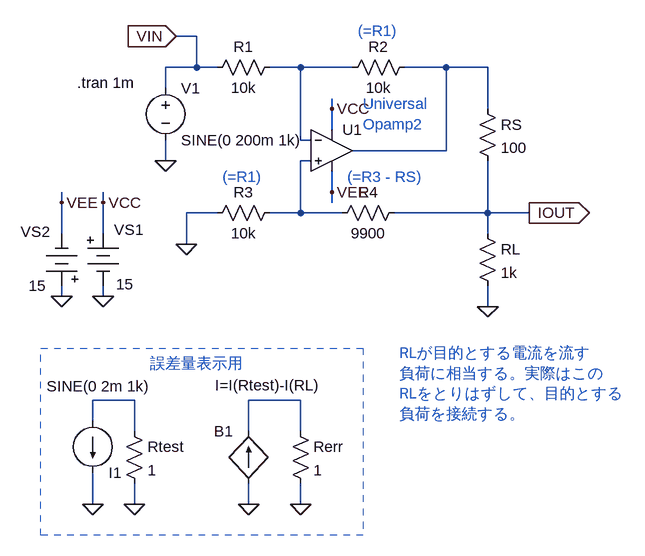
[diagram p0: schematic fig-01-02-32.asc]
fig-01-02-32.asc, the LTspice schematic file:
Version 4
SHEET 1 1216 680
WIRE -384 -208 -416 -208
WIRE -384 -160 -384 -208
WIRE -384 -160 -432 -160
WIRE -352 -160 -384 -160
WIRE -224 -160 -272 -160
WIRE -144 -160 -224 -160
WIRE 0 -160 -64 -160
WIRE 64 -160 0 -160
WIRE -432 -128 -432 -160
WIRE -176 -96 -176 -112
WIRE 64 -96 64 -160
WIRE -176 -64 -176 -96
WIRE -224 -48 -224 -160
WIRE -208 -48 -224 -48
WIRE 0 -32 0 -160
WIRE 0 -32 -144 -32
WIRE -432 -16 -432 -48
WIRE -208 -16 -224 -16
WIRE -176 32 -176 0
WIRE -592 48 -592 32
WIRE -528 48 -528 32
WIRE -176 48 -176 32
WIRE -352 64 -400 64
WIRE -224 64 -224 -16
WIRE -224 64 -272 64
WIRE -160 64 -224 64
WIRE 64 64 64 -16
WIRE 64 64 -80 64
WIRE 128 64 64 64
WIRE -592 96 -592 48
WIRE -528 96 -528 48
WIRE 64 96 64 64
WIRE -400 112 -400 64
WIRE -592 192 -592 176
WIRE -528 192 -528 176
WIRE 64 208 64 176
WIRE -480 352 -544 352
WIRE -224 352 -304 352
WIRE -544 384 -544 352
WIRE -480 400 -480 352
WIRE -304 400 -304 352
WIRE -224 400 -224 352
WIRE -544 512 -544 464
WIRE -480 512 -480 480
WIRE -304 512 -304 480
WIRE -224 512 -224 480
FLAG -592 192 0
FLAG -528 192 0
FLAG -592 48 VEE
FLAG -528 48 VCC
FLAG -432 -16 0
FLAG 64 208 0
FLAG 128 64 IOUT
IOPIN 128 64 Out
FLAG -544 512 0
FLAG -480 512 0
FLAG -304 512 0
FLAG -224 512 0
FLAG -176 -96 VCC
FLAG -176 32 VEE
FLAG -416 -208 VIN
IOPIN -416 -208 In
FLAG -400 112 0
SYMBOL Misc\\battery -528 80 R0
WINDOW 0 17 10 Left 2
WINDOW 3 20 94 Left 2
WINDOW 123 0 0 Left 0
WINDOW 39 0 0 Left 0
SYMATTR InstName VS1
SYMATTR Value 15
SYMBOL Misc\\battery -592 192 R180
WINDOW 0 18 99 Left 2
WINDOW 3 24 16 Left 2
WINDOW 123 0 0 Left 0
WINDOW 39 0 0 Left 0
SYMATTR InstName VS2
SYMATTR Value 15
SYMBOL voltage -432 -144 R0
WINDOW 123 0 0 Left 0
WINDOW 39 0 0 Left 0
SYMATTR InstName V1
SYMATTR Value SINE(0 200m 1k)
SYMBOL res 48 -112 R0
SYMATTR InstName RS
SYMATTR Value 100
SYMBOL res 48 80 R0
SYMATTR InstName RL
SYMATTR Value 1k
SYMBOL current -544 384 R0
WINDOW 0 24 80 Left 2
WINDOW 3 -71 -53 Left 2
WINDOW 123 0 0 Left 0
WINDOW 39 0 0 Left 0
SYMATTR InstName I1
SYMATTR Value SINE(0 2m 1k)
SYMBOL res -496 384 R0
SYMATTR InstName Rtest
SYMATTR Value 1
SYMBOL bi -304 480 R180
WINDOW 0 24 80 Left 2
WINDOW 3 -111 151 Left 2
SYMATTR InstName B1
SYMATTR Value I=I(Rtest)-I(RL)
SYMBOL res -240 384 R0
SYMATTR InstName Rerr
SYMATTR Value 1
SYMBOL Opamps\\UniversalOpamp2 -176 -32 R0
SYMATTR InstName U1
SYMBOL res -256 -176 R90
WINDOW 0 0 56 VBottom 2
WINDOW 3 32 56 VTop 2
SYMATTR InstName R1
SYMATTR Value 10k
SYMBOL res -256 48 R90
WINDOW 0 0 56 VBottom 2
WINDOW 3 32 56 VTop 2
SYMATTR InstName R3
SYMATTR Value 10k
SYMBOL res -48 -176 R90
WINDOW 0 0 56 VBottom 2
WINDOW 3 32 56 VTop 2
SYMATTR InstName R2
SYMATTR Value 10k
SYMBOL res -64 48 R90
WINDOW 0 0 56 VBottom 2
WINDOW 3 32 56 VTop 2
SYMATTR InstName R4
SYMATTR Value 9900
TEXT -568 -136 Left 2 !.tran 1m
TEXT -72 280 Left 2 ;RLが目的とする電流を流す\n負荷に相当する。実際はこの\nRLをとりはずして、目的とする\n負荷を接続する。
TEXT -456 296 Left 2 ;誤差量表示用
TEXT -128 -104 Left 2 ;Universal\nOpamp2
TEXT -344 8 Left 2 ;(=R1)
TEXT -152 8 Left 2 ;(=R3 - RS)
TEXT -136 -216 Left 2 ;(=R1)
RECTANGLE Normal -128 560 -624 272 2

The netlist it stands for:
* fig-01-02-32.asc
VS1 VCC 0 15
VS2 0 VEE 15
V1 VIN 0 SINE(0 200m 1k)
RS N002 IOUT 100
RL IOUT 0 1k
I1 N004 0 SINE(0 2m 1k)
Rtest N004 0 1
B1 0 N005 I=I(Rtest)-I(RL)
Rerr N005 0 1
XU1 N003 N001 VCC VEE N002 level.2 Avol=1Meg GBW=10Meg Slew=10Meg ilimit=25m rail=0 Vos=0 phimargin=45 en=0 enk=0 in=0 ink=0 Rin=500Meg  ; pins IN+ IN- V+ V- OUT
R1 N001 VIN 10k
R3 N003 0 10k
R2 N002 N001 10k
R4 IOUT N003 9900
.tran 1m
* RLが目的とする電流を流す
* 負荷に相当する。実際はこの
* RLをとりはずして、目的とする
* 負荷を接続する。
* 誤差量表示用
* Universal
* Opamp2
* (=R1)
* (=R3 - RS)
* (=R1)
.lib UniversalOpamps2.sub
.backanno
.end